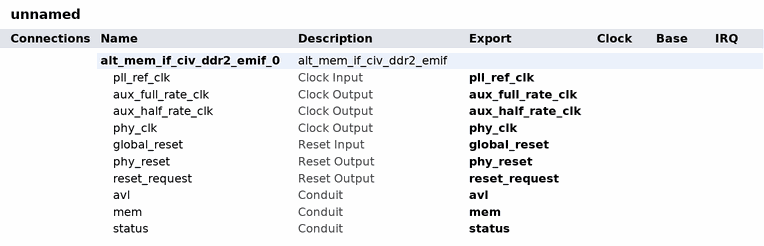
[diagram p0: system contents]
# Platform Designer (Qsys) system unnamed, Cyclone IV E EP4CE115F29C7
# Parameters at their usual value, and those the tool derives, are not listed.
package require qsys
create_system unnamed
set_project_property DEVICE_FAMILY {Cyclone IV E}
set_project_property DEVICE EP4CE115F29C7

add_instance alt_mem_if_civ_ddr2_emif_0 alt_mem_if_civ_ddr2_emif 1.0.0
set_instance_property alt_mem_if_civ_ddr2_emif_0 AUTO_EXPORT true
set_instance_parameter_value alt_mem_if_civ_ddr2_emif_0 ALT_MEM_IF_DEVICE_FAMILY {Cyclone IV GX}
set_instance_parameter_value alt_mem_if_civ_ddr2_emif_0 ALT_MEM_IF_ENABLE_DEBUG_INTERFACE false
set_instance_parameter_value alt_mem_if_civ_ddr2_emif_0 ALT_MEM_IF_ENABLE_LOCAL_CTRL_INTERFACE false
set_instance_parameter_value alt_mem_if_civ_ddr2_emif_0 ALT_MEM_IF_ENABLE_SOFT_RESET_INTERFACE false
set_instance_parameter_value alt_mem_if_civ_ddr2_emif_0 ALT_MEM_IF_MEM_CLK_FREQ 200.0
set_instance_parameter_value alt_mem_if_civ_ddr2_emif_0 ALT_MEM_IF_PLL_REFCLK_FREQ 100.0
set_instance_parameter_value alt_mem_if_civ_ddr2_emif_0 ALT_MEM_IF_SPEED_GRADE 6
set_instance_parameter_value alt_mem_if_civ_ddr2_emif_0 CTL_AUTO_POWER_DOWN_CYCLES 0
set_instance_parameter_value alt_mem_if_civ_ddr2_emif_0 CTL_COMMAND_QUEUE_LOOK_AHEAD_DEPTH 4
set_instance_parameter_value alt_mem_if_civ_ddr2_emif_0 CTL_DATA_RATE Full
set_instance_parameter_value alt_mem_if_civ_ddr2_emif_0 CTL_ENABLE_AUTO_ECC false
set_instance_parameter_value alt_mem_if_civ_ddr2_emif_0 CTL_ENABLE_AUTO_POWER_DOWN false
set_instance_parameter_value alt_mem_if_civ_ddr2_emif_0 CTL_ENABLE_AUTO_PRECHARGE_CONTROL false
set_instance_parameter_value alt_mem_if_civ_ddr2_emif_0 CTL_ENABLE_AUTO_REFRESH_CONTROLS false
set_instance_parameter_value alt_mem_if_civ_ddr2_emif_0 CTL_ENABLE_CONFIG_STATUS_INTERFACE false
set_instance_parameter_value alt_mem_if_civ_ddr2_emif_0 CTL_ENABLE_ECC_LOGIC false
set_instance_parameter_value alt_mem_if_civ_ddr2_emif_0 CTL_ENABLE_REORDERING true
set_instance_parameter_value alt_mem_if_civ_ddr2_emif_0 CTL_ENABLE_SELF_REFRESH_CONTROLS false
set_instance_parameter_value alt_mem_if_civ_ddr2_emif_0 CTL_LOCAL_MAXIMUM_BURST_COUNT 4
set_instance_parameter_value alt_mem_if_civ_ddr2_emif_0 CTL_LOCAL_TO_MEMORY_ADDRESS_MAPPING CHIP-ROW-BANK-COL
set_instance_parameter_value alt_mem_if_civ_ddr2_emif_0 CTL_REORDERING_STARVATION_LIMIT 10
set_instance_parameter_value alt_mem_if_civ_ddr2_emif_0 EX_DESIGN_GEN_SIM true
set_instance_parameter_value alt_mem_if_civ_ddr2_emif_0 EX_DESIGN_GEN_SYNTH true
set_instance_parameter_value alt_mem_if_civ_ddr2_emif_0 EX_DESIGN_HDL_FORMAT Verilog
set_instance_parameter_value alt_mem_if_civ_ddr2_emif_0 EX_DESIGN_SEL_DESIGN {AltMemPHY Example Design}
set_instance_parameter_value alt_mem_if_civ_ddr2_emif_0 MEM_ACTIVE_TO_PRECHARGE_TIME 40.0
set_instance_parameter_value alt_mem_if_civ_ddr2_emif_0 MEM_ACTIVE_TO_READ_WRITE_TIME 15.0
set_instance_parameter_value alt_mem_if_civ_ddr2_emif_0 MEM_ADDITIVE_CAS_LATENCY Disabled
set_instance_parameter_value alt_mem_if_civ_ddr2_emif_0 MEM_ADDR_COMMAND_INPUT_HOLD_TIME 600
set_instance_parameter_value alt_mem_if_civ_ddr2_emif_0 MEM_ADDR_COMMAND_INPUT_SETUP_TIME 600
set_instance_parameter_value alt_mem_if_civ_ddr2_emif_0 MEM_AUTO_REFRESH_COMMAND_INTERVAL 75.0
set_instance_parameter_value alt_mem_if_civ_ddr2_emif_0 MEM_BANK_ADDR_WIDTH 2
set_instance_parameter_value alt_mem_if_civ_ddr2_emif_0 MEM_BURST_LENGTH 4
set_instance_parameter_value alt_mem_if_civ_ddr2_emif_0 MEM_BURST_ORDERING Sequential
set_instance_parameter_value alt_mem_if_civ_ddr2_emif_0 MEM_CAS_3_MAX_FREQ 200.0
set_instance_parameter_value alt_mem_if_civ_ddr2_emif_0 MEM_CAS_4_MAX_FREQ 200.0
set_instance_parameter_value alt_mem_if_civ_ddr2_emif_0 MEM_CAS_5_MAX_FREQ 200.0
set_instance_parameter_value alt_mem_if_civ_ddr2_emif_0 MEM_CAS_6_MAX_FREQ 200.0
set_instance_parameter_value alt_mem_if_civ_ddr2_emif_0 MEM_CAS_LATENCY 3
set_instance_parameter_value alt_mem_if_civ_ddr2_emif_0 MEM_CHIP_SELECTS_PER_DIMM 1
set_instance_parameter_value alt_mem_if_civ_ddr2_emif_0 MEM_COLUMN_ADDR_WIDTH 10
set_instance_parameter_value alt_mem_if_civ_ddr2_emif_0 MEM_DQS_DQ_SKEW 400
set_instance_parameter_value alt_mem_if_civ_ddr2_emif_0 MEM_DQS_FALLING_EDGE_HOLD_TIME_FROM_CK 0.2
set_instance_parameter_value alt_mem_if_civ_ddr2_emif_0 MEM_DQS_FALLING_EDGE_TO_CK_SETUP_TIME 0.2
set_instance_parameter_value alt_mem_if_civ_ddr2_emif_0 MEM_DQS_OUTPUT_ACCESS_TIME_FROM_CK 500
set_instance_parameter_value alt_mem_if_civ_ddr2_emif_0 MEM_DQ_DM_INPUT_HOLD_TIME_TO_DQS 400
set_instance_parameter_value alt_mem_if_civ_ddr2_emif_0 MEM_DQ_DM_INPUT_SETUP_TIME_TO_DQS 400
set_instance_parameter_value alt_mem_if_civ_ddr2_emif_0 MEM_DQ_HOLD_SKEW_FACTOR 450
set_instance_parameter_value alt_mem_if_civ_ddr2_emif_0 MEM_DQ_OUTPUT_ACCESS_TIME_FROM_CK 600
set_instance_parameter_value alt_mem_if_civ_ddr2_emif_0 MEM_DQ_PER_DQS 8
set_instance_parameter_value alt_mem_if_civ_ddr2_emif_0 MEM_DRIVE_DM_PINS_FROM_FPGA true
set_instance_parameter_value alt_mem_if_civ_ddr2_emif_0 MEM_DRIVE_STRENGTH Normal
set_instance_parameter_value alt_mem_if_civ_ddr2_emif_0 MEM_ENABLE_DEVICE_DLL true
set_instance_parameter_value alt_mem_if_civ_ddr2_emif_0 MEM_FIRST_DQS_EDGE_TO_ASSOC_CLOCK_EDGE 0.25
set_instance_parameter_value alt_mem_if_civ_ddr2_emif_0 MEM_FORMAT {Discrete Device}
set_instance_parameter_value alt_mem_if_civ_ddr2_emif_0 MEM_FOUR_WINDOW_TIME 37.5
set_instance_parameter_value alt_mem_if_civ_ddr2_emif_0 MEM_LOAD_MODE_REGISTER_COMMAND_PERIOD 10.0
set_instance_parameter_value alt_mem_if_civ_ddr2_emif_0 MEM_MAX_MEM_FREQ 200.0
set_instance_parameter_value alt_mem_if_civ_ddr2_emif_0 MEM_MEM_INIT_TIME_AT_POWER_UP 200.0
set_instance_parameter_value alt_mem_if_civ_ddr2_emif_0 MEM_NUM_CHIP_SELECTS 1
set_instance_parameter_value alt_mem_if_civ_ddr2_emif_0 MEM_NUM_CLOCK_PAIRS 1
set_instance_parameter_value alt_mem_if_civ_ddr2_emif_0 MEM_ODT_SETTING Disabled
set_instance_parameter_value alt_mem_if_civ_ddr2_emif_0 MEM_PRECHARGE_ADDR_BIT 10
set_instance_parameter_value alt_mem_if_civ_ddr2_emif_0 MEM_PRECHARGE_COMMAND_PERIOD 15.0
set_instance_parameter_value alt_mem_if_civ_ddr2_emif_0 MEM_RAS_TO_RAS_DELAY 7.5
set_instance_parameter_value alt_mem_if_civ_ddr2_emif_0 MEM_READ_TO_PRECHARGE_TIME 7.5
set_instance_parameter_value alt_mem_if_civ_ddr2_emif_0 MEM_REFRESH_COMMAND_INTERVAL 7.0
set_instance_parameter_value alt_mem_if_civ_ddr2_emif_0 MEM_ROW_ADDR_WIDTH 13
set_instance_parameter_value alt_mem_if_civ_ddr2_emif_0 MEM_TOTAL_DQ_WIDTH 8
set_instance_parameter_value alt_mem_if_civ_ddr2_emif_0 MEM_VENDOR JEDEC
set_instance_parameter_value alt_mem_if_civ_ddr2_emif_0 MEM_WRITE_RECOVERY_TIME 15.0
set_instance_parameter_value alt_mem_if_civ_ddr2_emif_0 MEM_WRITE_TO_READ_PERIOD 2
set_instance_parameter_value alt_mem_if_civ_ddr2_emif_0 PHY_ADDR_CMD_CLOCK_PHASE 90
set_instance_parameter_value alt_mem_if_civ_ddr2_emif_0 PHY_CALIBRATION_TYPE_FOR_SIMULATION {Quick Calibration}

# exported interfaces
add_interface aux_full_rate_clk clock source
set_interface_property aux_full_rate_clk EXPORT_OF alt_mem_if_civ_ddr2_emif_0.aux_full_rate_clk
add_interface aux_half_rate_clk clock source
set_interface_property aux_half_rate_clk EXPORT_OF alt_mem_if_civ_ddr2_emif_0.aux_half_rate_clk
add_interface avl conduit end
set_interface_property avl EXPORT_OF alt_mem_if_civ_ddr2_emif_0.avl
add_interface global_reset reset sink
set_interface_property global_reset EXPORT_OF alt_mem_if_civ_ddr2_emif_0.global_reset
add_interface mem conduit end
set_interface_property mem EXPORT_OF alt_mem_if_civ_ddr2_emif_0.mem
add_interface phy_clk clock source
set_interface_property phy_clk EXPORT_OF alt_mem_if_civ_ddr2_emif_0.phy_clk
add_interface phy_reset reset source
set_interface_property phy_reset EXPORT_OF alt_mem_if_civ_ddr2_emif_0.phy_reset
add_interface pll_ref_clk clock sink
set_interface_property pll_ref_clk EXPORT_OF alt_mem_if_civ_ddr2_emif_0.pll_ref_clk
add_interface reset_request reset source
set_interface_property reset_request EXPORT_OF alt_mem_if_civ_ddr2_emif_0.reset_request
add_interface status conduit end
set_interface_property status EXPORT_OF alt_mem_if_civ_ddr2_emif_0.status

set_interconnect_requirement {$system} qsys_mm.clockCrossingAdapter HANDSHAKE
set_interconnect_requirement {$system} qsys_mm.enableEccProtection FALSE
set_interconnect_requirement {$system} qsys_mm.insertDefaultSlave FALSE
set_interconnect_requirement {$system} qsys_mm.maxAdditionalLatency 1

save_system unnamed.qsys
